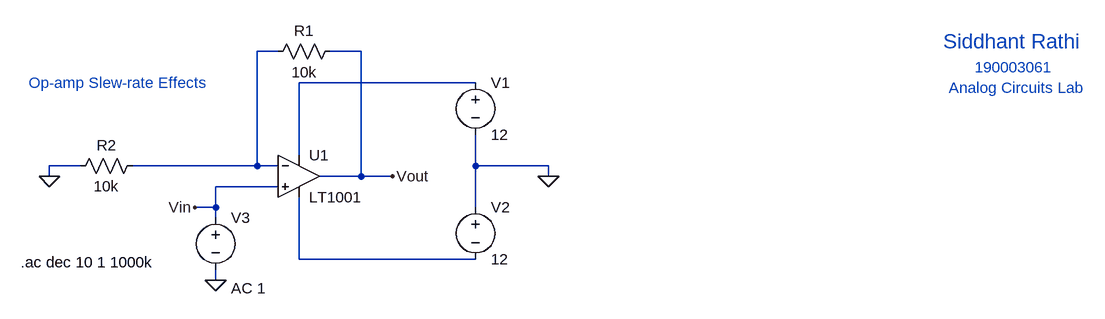
[diagram p0: schematic SlewRate.asc]
SlewRate.asc, the LTspice schematic file:
Version 4
SHEET 1 1436 680
WIRE 176 -16 144 -16
WIRE 304 -16 256 -16
WIRE 480 32 208 32
WIRE 208 144 208 32
WIRE -128 160 -176 160
WIRE 144 160 144 -16
WIRE 144 160 -48 160
WIRE 176 160 144 160
WIRE 480 160 480 112
WIRE 592 160 480 160
WIRE -176 176 -176 160
WIRE 304 176 304 -16
WIRE 304 176 240 176
WIRE 352 176 304 176
WIRE 592 176 592 160
WIRE 176 192 80 192
WIRE 80 224 80 192
WIRE 80 224 48 224
WIRE 480 224 480 160
WIRE 80 240 80 224
WIRE 208 304 208 208
WIRE 480 304 208 304
WIRE 80 336 80 320
FLAG -176 176 0
FLAG 80 336 0
FLAG 592 176 0
FLAG 48 224 Vin
FLAG 352 176 Vout
SYMBOL voltage 480 16 R0
WINDOW 123 0 0 Left 0
WINDOW 39 0 0 Left 0
SYMATTR InstName V1
SYMATTR Value 12
SYMBOL voltage 480 208 R0
WINDOW 123 0 0 Left 0
WINDOW 39 0 0 Left 0
SYMATTR InstName V2
SYMATTR Value 12
SYMBOL OpAmps\\LT1001 208 112 R0
SYMATTR InstName U1
SYMBOL res 272 -32 R90
WINDOW 0 0 56 VBottom 2
WINDOW 3 32 56 VTop 2
SYMATTR InstName R1
SYMATTR Value 10k
SYMBOL res -32 144 R90
WINDOW 0 0 56 VBottom 2
WINDOW 3 32 56 VTop 2
SYMATTR InstName R2
SYMATTR Value 10k
SYMBOL voltage 80 224 R0
WINDOW 123 24 124 Left 2
WINDOW 39 0 0 Left 0
SYMATTR InstName V3
SYMATTR Value ""
SYMATTR Value2 AC 1
TEXT -220 308 Left 2 !.ac dec 10 1 1000k
TEXT 1200 -32 Left 3 ;Siddhant Rathi
TEXT 1248 8 Left 2 ;190003061
TEXT 1208 40 Left 2 ;Analog Circuits Lab
TEXT -208 32 Left 2 ;Op-amp Slew-rate Effects

The netlist it stands for:
* SlewRate.asc
V1 N002 0 12
V2 0 N003 12
XU1 Vin N001 N002 N003 Vout LT1001  ; pins In+ In- V+ V- OUT
R1 Vout N001 10k
R2 N001 0 10k
V3 Vin 0 AC 1
.ac dec 10 1 1000k
* Siddhant Rathi
* 190003061
* Analog Circuits Lab
* Op-amp Slew-rate Effects
.lib LTC.lib
.backanno
.end